# EAGLE design W511X (EAGLE 6.6.0)
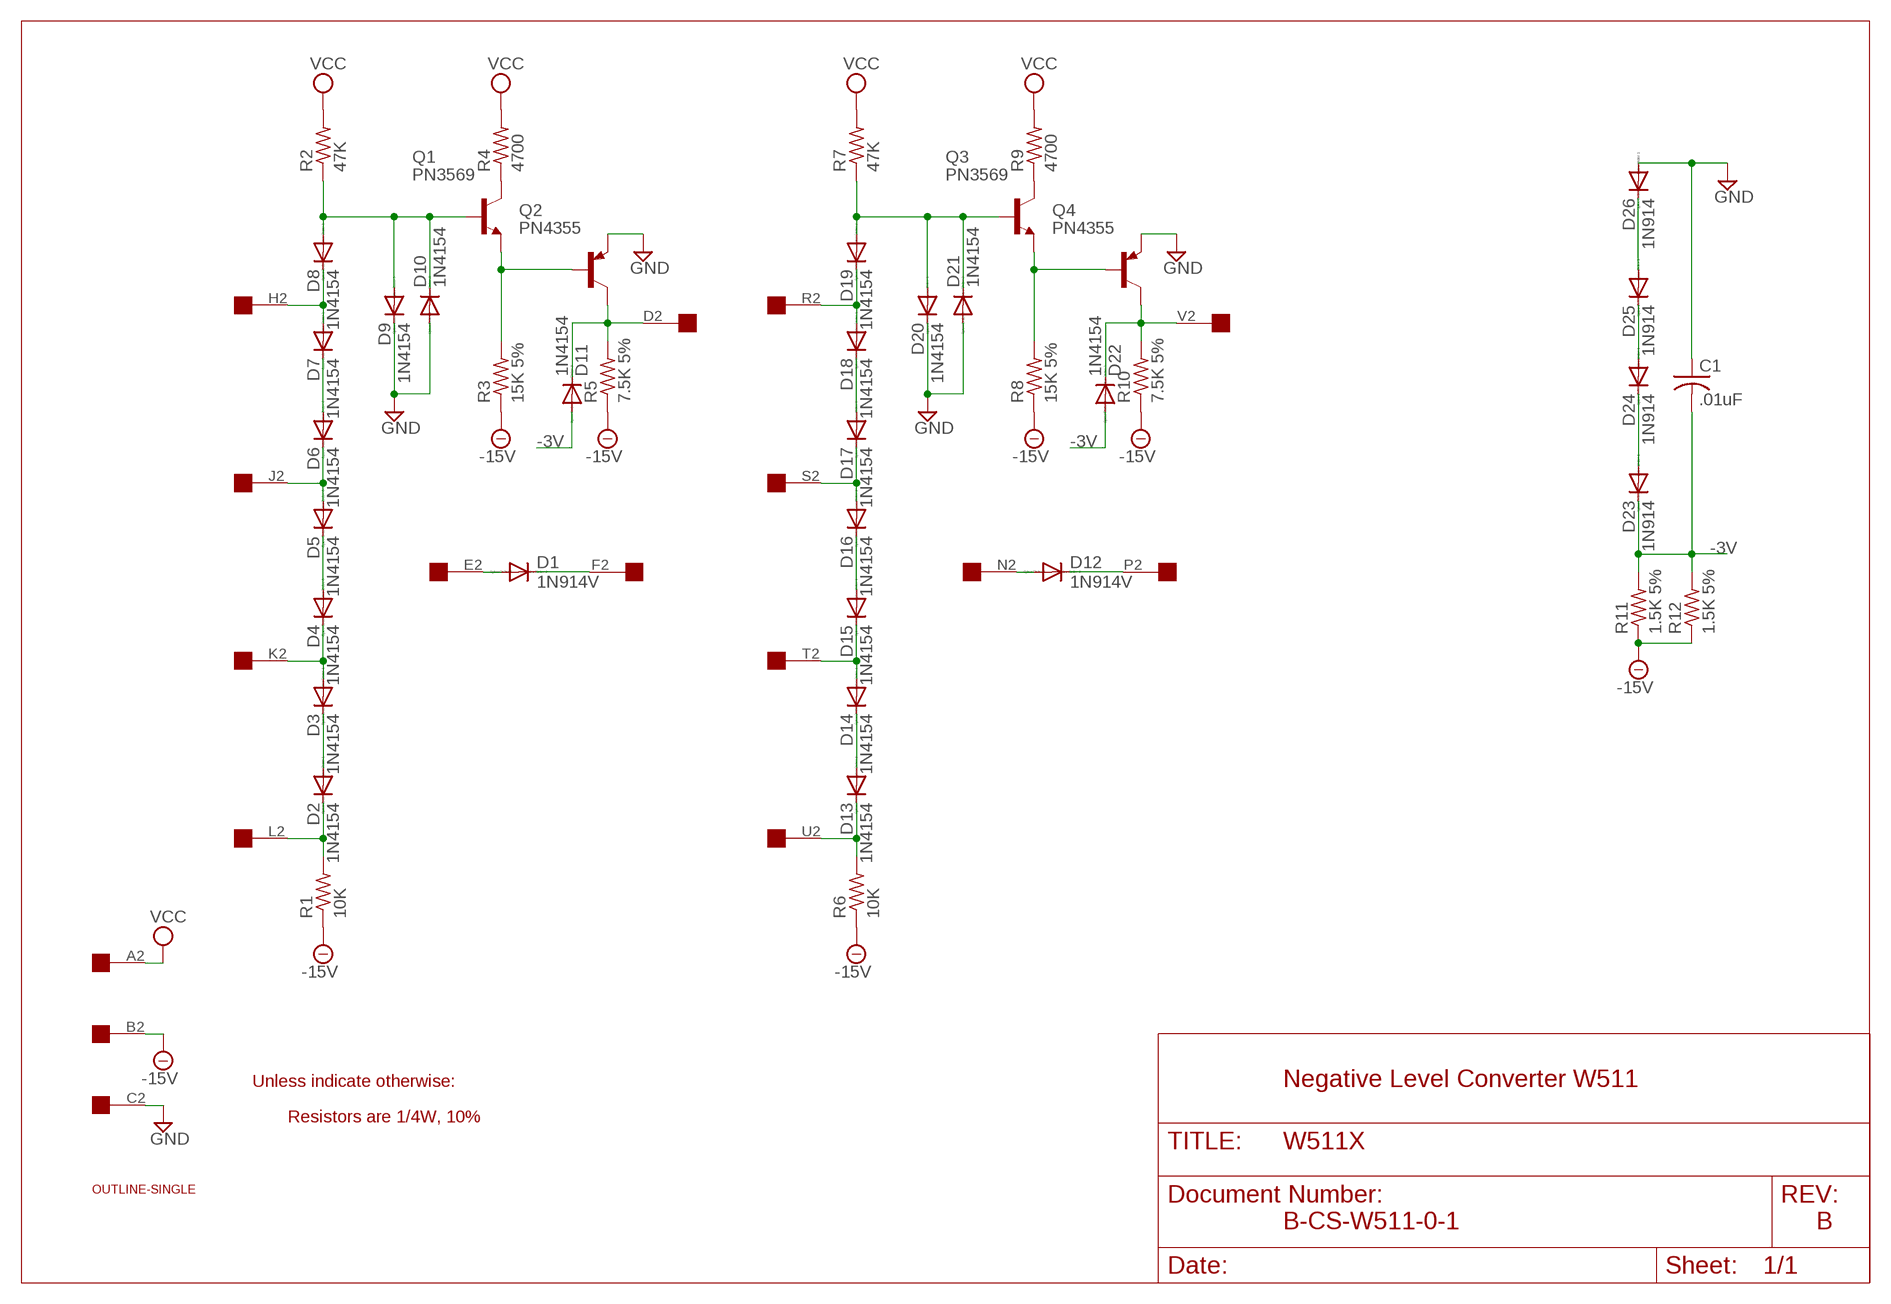
[diagram p0: schematic, sheet 1]

## Parts
C1  .01uF  C-US050-025X075  [C050-025X075]
D1  1N914V  1N4148DO35-10  [DO35-10]
D2  1N4154  1N4148DO35-10  [DO35-10]
D3  1N4154  1N4148DO35-10  [DO35-10]
D4  1N4154  1N4148DO35-10  [DO35-10]
D5  1N4154  1N4148DO35-10  [DO35-10]
D6  1N4154  1N4148DO35-10  [DO35-10]
D7  1N4154  1N4148DO35-10  [DO35-10]
D8  1N4154  1N4148DO35-10  [DO35-10]
D9  1N4154  1N4148DO35-10  [DO35-10]
D10  1N4154  1N4148DO35-10  [DO35-10]
D11  1N4154  1N4148DO35-10  [DO35-10]
D12  1N914V  1N4148DO35-10  [DO35-10]
D13  1N4154  1N4148DO35-10  [DO35-10]
D14  1N4154  1N4148DO35-10  [DO35-10]
D15  1N4154  1N4148DO35-10  [DO35-10]
D16  1N4154  1N4148DO35-10  [DO35-10]
D17  1N4154  1N4148DO35-10  [DO35-10]
D18  1N4154  1N4148DO35-10  [DO35-10]
D19  1N4154  1N4148DO35-10  [DO35-10]
D20  1N4154  1N4148DO35-10  [DO35-10]
D21  1N4154  1N4148DO35-10  [DO35-10]
D22  1N4154  1N4148DO35-10  [DO35-10]
D23  1N914  1N4148DO35-10  [DO35-10]
D24  1N914  1N4148DO35-10  [DO35-10]
D25  1N914  1N4148DO35-10  [DO35-10]
D26  1N914  1N4148DO35-10  [DO35-10]
EDGE  EDGE-1  [EDGE-CON1]
Q1  PN3569  2N2102  [TO5]
Q2  PN4355  2N2904  [TO39]
Q3  PN3569  2N2102  [TO5]
Q4  PN4355  2N2904  [TO39]
R1  10K  R-US_0207/10  [0207/10]
R2  47K  R-US_0207/10  [0207/10]
R3  15K 5%  R-US_0207/10  [0207/10]
R4  4700  R-US_0207/10  [0207/10]
R5  7.5K 5%  R-US_0207/10  [0207/10]
R6  10K  R-US_0207/10  [0207/10]
R7  47K  R-US_0207/10  [0207/10]
R8  15K 5%  R-US_0207/10  [0207/10]
R9  4700  R-US_0207/10  [0207/10]
R10  7.5K 5%  R-US_0207/10  [0207/10]
R11  1.5K 5%  R-US_0207/10  [0207/10]
R12  1.5K 5%  R-US_0207/10  [0207/10]
U$1  OUTLINE-SINGLE  [SINGLE]

## Nets
-3V: C1.2 D11.A D22.A D23.C R11.2 R12.2
-15V [Supply]: EDGE.B2 R1.1 R3.1 R5.1 R6.1 R8.1 R10.1 R11.1 R12.1
GND [Supply]: C1.1 D9.C D10.A D20.C D21.A D26.A EDGE.C2 Q2.1(E) Q4.1(E)
N$1: D2.A D3.C
N$2: D2.C EDGE.L2 R1.2
N$3: D3.A D4.C EDGE.K2
N$4: D25.A D26.C
N$5: D24.A D25.C
N$6: D23.A D24.C
N$7: D1.C EDGE.F2
N$8: D4.A D5.C
N$9: D5.A D6.C EDGE.J2
N$10: D6.A D7.C
N$11: D7.A D8.C EDGE.H2
N$12: D8.A D9.A D10.C Q1.2(B) R2.1
N$13: Q1.1(E) Q2.2(B) R3.2
N$14: D11.C EDGE.D2 Q2.3(C) R5.2
N$15: Q1.3(C) R4.1
N$16: D1.A EDGE.E2
N$17: D13.A D14.C
N$18: D13.C EDGE.U2 R6.2
N$19: D14.A D15.C EDGE.T2
N$20: D15.A D16.C
N$21: D16.A D17.C EDGE.S2
N$23: D17.A D18.C
N$24: D18.A D19.C EDGE.R2
N$25: D19.A D20.A D21.C Q3.2(B) R7.1
N$26: Q3.3(C) R9.1
N$27: Q3.1(E) Q4.2(B) R8.2
N$28: D22.C EDGE.V2 Q4.3(C) R10.2
N$29: D12.C EDGE.P2
N$30: D12.A EDGE.N2
VCC [Supply]: EDGE.A2 R2.2 R4.2 R7.2 R9.2
Unconnected: EDGE.M2

## Notes on the sheet
- Unless indicate otherwise: | Negative Level Converter W511
- Resistors are 1/4W, 10%
- B-CS-W511-0-1 | B

## Library data of the parts
C1 = rcl:C-US: CAPACITOR, American symbol
D1-D26 = diode:1N4148: DIODE high speed (Philips)
EDGE = dec-con:EDGE-1: Single-Sided DEC Edge Connector -- (side 2)
Q1 Q3 = transistor-npn:2N2102: NPN Transistor
Q2 Q4 = transistor-pnp:2N2904*: PNP Transistror
R1-R12 = rcl:R-US_: RESISTOR, American symbol
U$1 = dec-con:OUTLINE-*: Board outlines for DEC boards.

## Net classes
1 Supply: width 0.813 mm

## Board
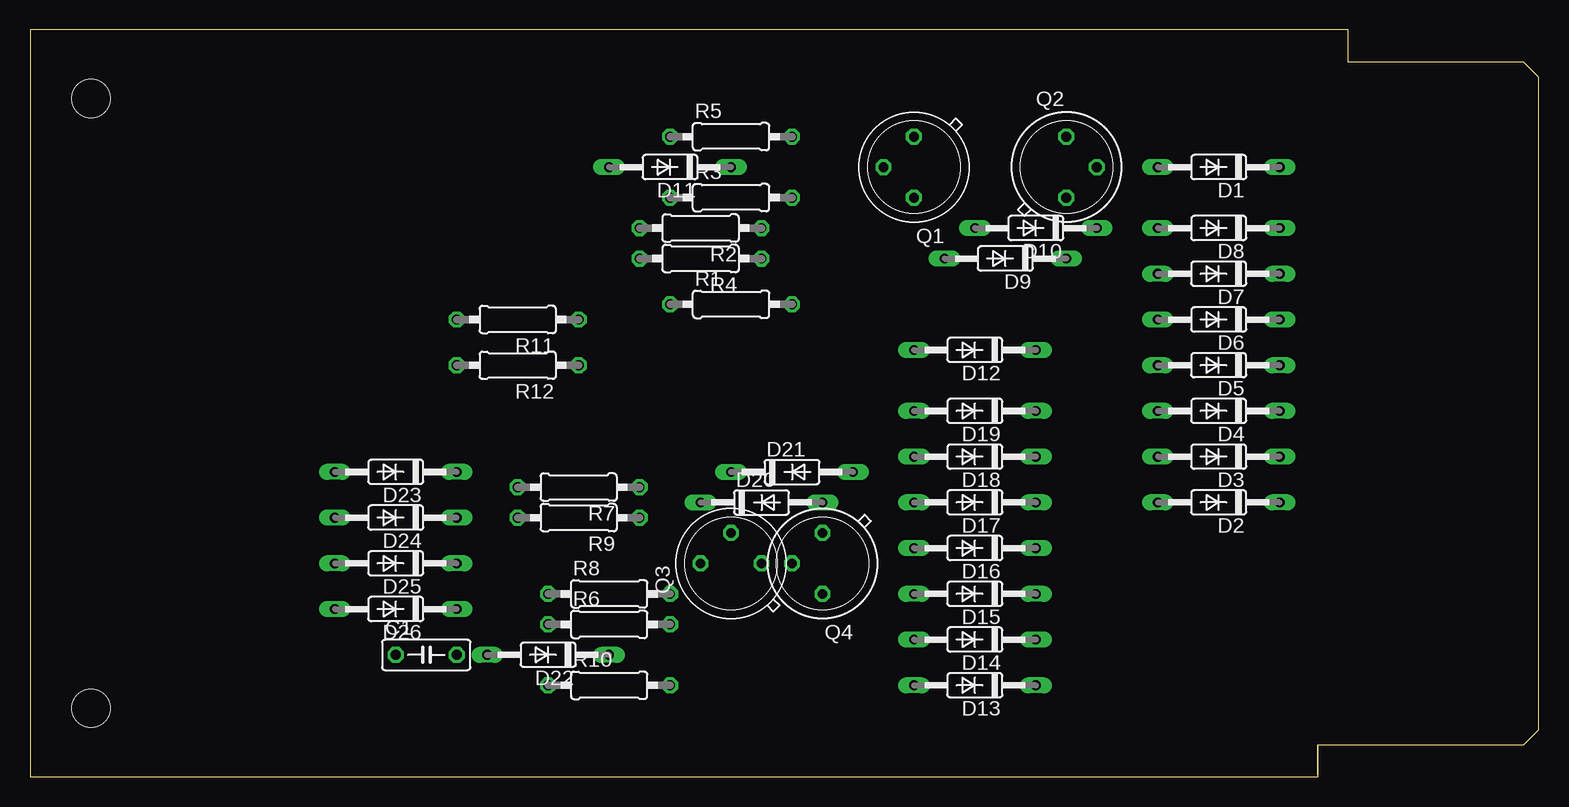
[diagram p1: board, top side]
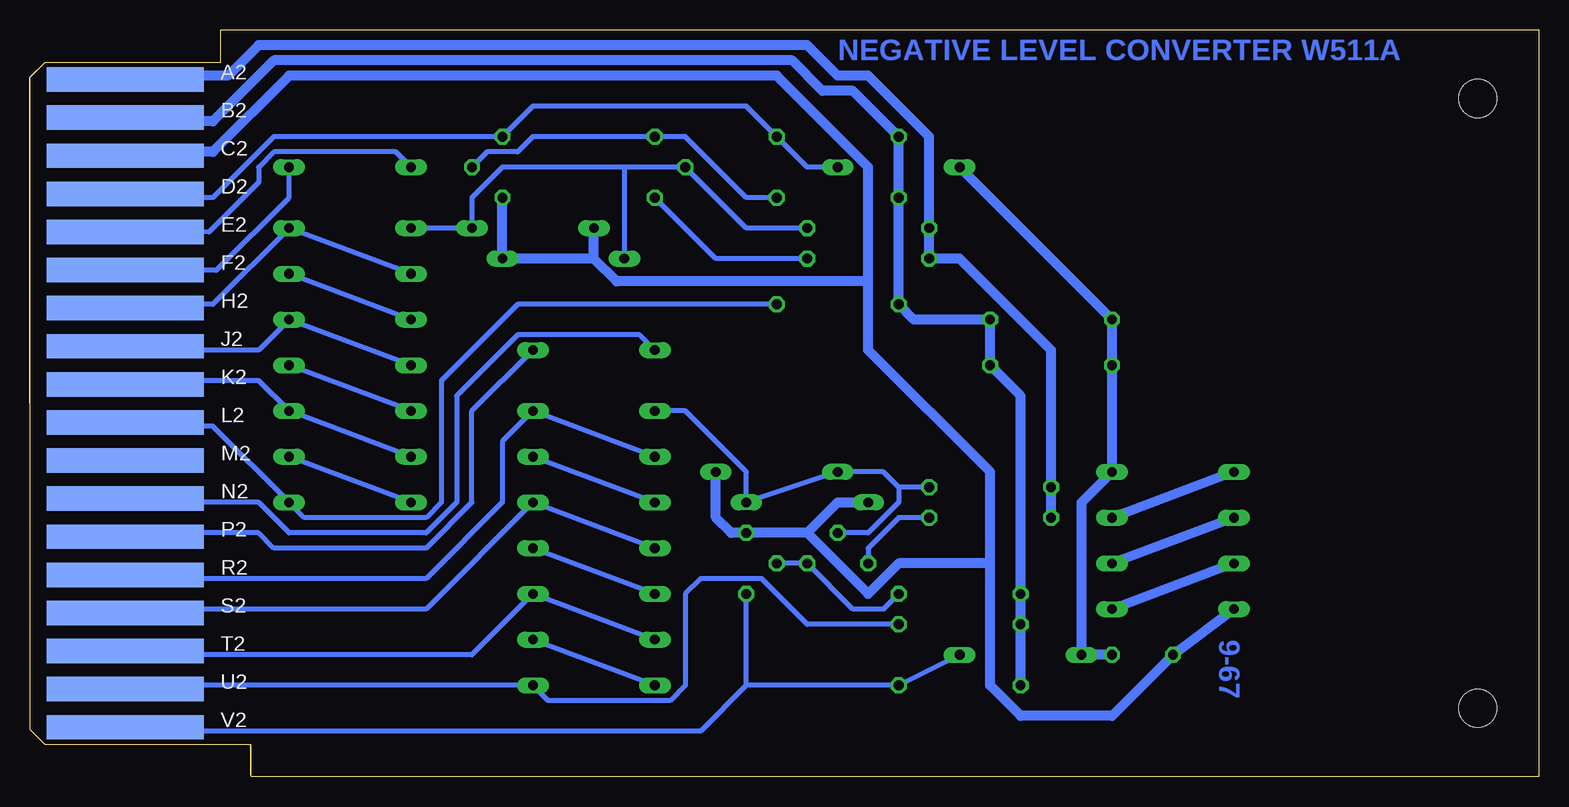
[diagram p2: board, bottom side, seen from below]

Size 125.73 x 62.23 mm. Coordinates in mm from the lower left corner, seen from the top.
Copper layers (1+16): Top 0.035mm / dielectric 1.5mm / Bottom 0.035mm
Design rules "16mils": minimum track width 16mil, minimum drill 32mil, track to track 15mil, track to pad 10mil, pad to pad 10mil, via to via 10mil, smd to smd 10mil, copper to edge 13mil, drill to drill 10mil, minimum pad ring 10mil, minimum via ring 8mil, stop-mask expansion 0mil, vias tented up to drill 0mil, thermal gap 10mil

### Footprints (pad centres in the part's own frame; a part is rotated, then mirrored left to right if it is on the bottom)
C050-025X075 = drill 0.813 octagon: 1 -2.54,0; 2 2.54,0
DO35-10 = drill 0.813 long: A 5.08,0; C -5.08,0
EDGE-CON1 = smd 13.106 x 2.032 bottom: A2 7.938,4.128; B2 7.938,7.303; C2 7.938,10.477; D2 7.938,13.652; E2 7.938,16.828; F2 7.938,20.003; H2 7.938,23.177; J2 7.938,26.352; K2 7.938,29.527; L2 7.938,32.703; M2 7.938,35.877; N2 7.938,39.053; P2 7.938,42.227; R2 7.938,45.403; S2 7.938,48.578; T2 7.938,51.752; U2 7.938,54.928; V2 7.938,58.102
TO5 = drill 0.813 octagon: 1 0,-2.54; 2 2.54,0; 3 0,2.54
TO39 = drill 0.813 octagon: 1 0,-2.54; 2 2.54,0; 3 0,2.54
0207/10 = drill 0.813 octagon: 1 -5.08,0; 2 5.08,0
SINGLE = hole 3.175: 120.65,56.515; 120.65,5.715

### Placement (x,y rotation side)
C1  33.02,10.16 0 top
D1  99.06,50.8 180 top
D2  99.06,22.86 180 top
D3  99.06,26.67 180 top
D4  99.06,30.48 180 top
D5  99.06,34.29 180 top
D6  99.06,38.1 180 top
D7  99.06,41.91 180 top
D8  99.06,45.72 180 top
D9  81.28,43.18 180 top
D10  83.82,45.72 180 top
D11  53.34,50.8 180 top
D12  78.74,35.56 180 top
D13  78.74,7.62 180 top
D14  78.74,11.43 180 top
D15  78.74,15.24 180 top
D16  78.74,19.05 180 top
D17  78.74,22.86 180 top
D18  78.74,26.67 180 top
D19  78.74,30.48 180 top
D20  60.96,22.86 0 top
D21  63.5,25.4 0 top
D22  43.18,10.16 180 top
D23  30.48,25.4 180 top
D24  30.48,21.59 180 top
D25  30.48,17.78 180 top
D26  30.48,13.97 180 top
EDGE  125.73,62.23 180 top
Q1  73.66,50.8 180 top
Q2  86.36,50.8 0 top
Q3  58.42,17.78 90 top
Q4  66.04,17.78 180 top
R1  58.42,39.37 0 top
R2  55.88,45.72 180 top
R3  58.42,48.26 0 top
R4  55.88,43.18 180 top
R5  58.42,53.34 0 top
R6  48.26,12.7 0 top
R7  45.72,24.13 180 top
R8  48.26,15.24 0 top
R9  45.72,21.59 180 top
R10  48.26,7.62 0 top
R11  40.64,38.1 180 top
R12  40.64,34.29 180 top
U$1  125.73,62.23 180 top

### Tracks (layer width: path | path; a pad name or v marks a point on that pad's centre or on a via)
-3V
  Bottom 0.813: C1.2 D22.A 38.1,22.86 D23.C R12.2 R11.2 D11.A
-15V
  Bottom 0.813: EDGE.B2 117.13,54.9 116.84,54.61 110.49,54.61 105.41,59.69 62.23,59.69 59.69,57.15 57.15,57.15 R5.1 R3.1 R1.1 52.07,38.1 R11.1 R12.1 43.18,31.75 R8.1 R6.1 R10.1
GND
  Bottom 0.813: EDGE.C2 117.17,51.74 116.84,52.07 110.49,52.07 104.14,58.42 63.5,58.42 55.88,50.8 55.88,41.27 | 78.74,43.18 D10.A | 78.74,43.18 76.83,41.27 55.88,41.27 | Q2.1 D9.C 78.74,43.18 | D26.A C1.1 35.56,5.08 43.18,5.08 45.72,7.62 45.72,17.78 | 45.72,17.78 45.72,25.4 55.88,35.56 55.88,41.27 | 60.96,20.32 58.42,22.86 D20.C | 60.96,20.32 Q4.1 67.31,20.32 68.58,21.59 D21.A | 60.96,20.32 55.88,15.24 53.34,17.78 45.72,17.78
N$1
  Bottom 0.406: D2.A D3.C
N$2
  Bottom 0.406: EDGE.L2 117.17,29.54 116.84,29.21 110.49,29.21 D2.C 102.87,21.59 92.71,21.59 91.44,22.86 91.44,33.02 85.09,39.37 R1.2
N$3
  Bottom 0.406: D3.A D4.C 106.68,33.02 116.84,33.02 117.14,32.72 EDGE.K2
N$4
  Bottom 0.813: D25.A D26.C
N$5
  Bottom 0.813: D24.A D25.C
N$6
  Bottom 0.813: D23.A D24.C
N$7
  Bottom 0.406: EDGE.F2 110.21,42.19 104.14,48.26 D1.C
N$8
  Bottom 0.406: D4.A D5.C
N$9
  Bottom 0.406: D5.A D6.C 106.68,35.56 116.84,35.56 117.17,35.89 EDGE.J2
N$10
  Bottom 0.406: D6.A D7.C
N$11
  Bottom 0.406: D7.A D8.C 110.49,39.37 116.84,39.37 EDGE.H2
N$12
  Bottom 0.406: R2.1 66.04,45.72 Q1.2 76.2,50.8 | 76.2,50.8 D9.A | 76.2,50.8 86.36,50.8 88.9,48.26 D10.C D8.A
N$13
  Bottom 0.406: R3.2 66.04,48.26 71.12,53.34 Q1.1 83.82,53.34 85.09,52.07 87.63,52.07 Q2.2
N$14
  Bottom 0.406: EDGE.D2 117.14,48.56 116.84,48.26 110.49,48.26 105.41,53.34 Q2.3 83.82,55.88 66.04,55.88 R5.2 60.96,50.8 D11.C
N$15
  Bottom 0.406: R4.1 68.58,43.18 Q1.3
N$16
  Bottom 0.406: EDGE.E2 110.82,45.39 106.68,49.53 106.68,50.8 105.41,52.07 95.25,52.07 D1.A
N$17
  Bottom 0.406: D13.A D14.C
N$18
  Bottom 0.406: EDGE.U2 117.2,7.26 116.84,7.62 D13.C 82.55,6.35 72.39,6.35 71.12,7.62 71.12,15.24 69.85,16.51 64.77,16.51 60.96,12.7 R6.2
N$19
  Bottom 0.406: EDGE.T2 117.17,10.49 116.84,10.16 88.9,10.16 D15.C D14.A
N$20
  Bottom 0.406: D15.A D16.C
N$21
  Bottom 0.406: EDGE.S2 117.14,13.66 116.84,13.97 92.71,13.97 D17.C D16.A
N$23
  Bottom 0.406: D17.A D18.C
N$24
  Bottom 0.406: EDGE.R2 117.17,16.84 116.84,16.51 92.71,16.51 86.36,22.86 86.36,27.94 D19.C D18.A
N$25
  Bottom 0.406: R7.1 53.34,24.13 | Q3.2 55.88,20.32 53.34,22.86 53.34,24.13 | 53.34,24.13 54.61,25.4 D21.C D20.A 66.04,25.4 71.12,30.48 D19.A
N$26
  Bottom 0.406: R9.1 53.34,21.59 55.88,19.05 Q3.3
N$27
  Bottom 0.406: R8.2 54.61,13.97 57.15,13.97 Q3.1 Q4.2
N$28
  Bottom 0.406: EDGE.V2 117.16,4.13 116.84,3.81 69.85,3.81 66.04,7.62 | D22.C R10.2 66.04,7.62 | 66.04,7.62 Q4.3
N$29
  Bottom 0.406: EDGE.P2 117.17,19.99 116.84,20.32 106.68,20.32 105.41,19.05 92.71,19.05 88.9,22.86 88.9,30.48 D12.C
N$30
  Bottom 0.406: EDGE.N2 117.17,23.19 116.84,22.86 106.68,22.86 104.14,20.32 92.71,20.32 90.17,22.86 90.17,31.75 85.09,36.83 74.93,36.83 D12.A
VCC
  Bottom 0.813: EDGE.A2 117.22,58.04 116.84,58.42 109.22,58.42 106.68,60.96 60.96,60.96 58.42,58.42 55.88,58.42 50.8,53.34 R2.2 R4.2 48.26,43.18 40.64,35.56 R7.2 R9.2

### Text on the board
Bottom: NEGATIVE LEVEL CONVERTER W511A | 9-67